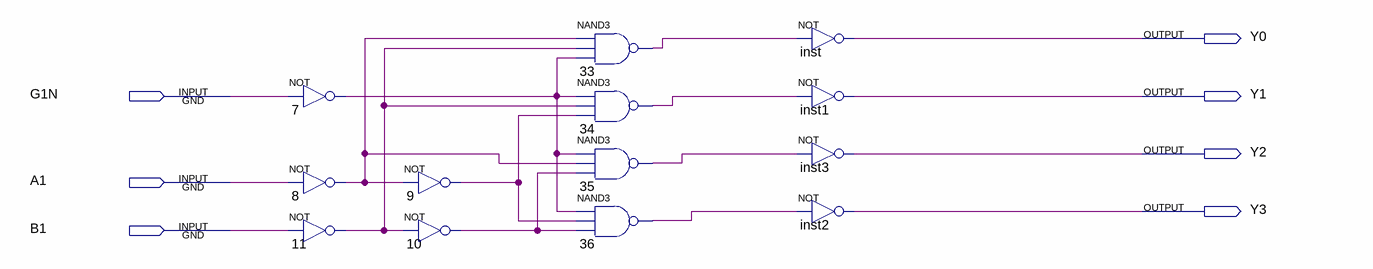
[diagram p0: schematic sheet]
// Quartus schematic DMUX.bdf as structural Verilog: 13 symbols, 7 pins
module DMUX (
  input  G1N,
  input  A1,
  input  B1,
  output Y0,
  output Y1,
  output Y2,
  output Y3
);

  wire n7_out, n8_out, n9_out, n10_out, n11_out, n33_out, n34_out, n35_out, n36_out;

  not u_7 (n7_out, G1N);
  not u_8 (n8_out, A1);
  not u_11 (n11_out, B1);
  not u_9 (n9_out, n8_out);
  not u_10 (n10_out, n11_out);
  nand u_33 (n33_out, n8_out, n11_out, n7_out);
  nand u_34 (n34_out, n7_out, n11_out, n9_out);
  nand u_35 (n35_out, n7_out, n8_out, n10_out);
  nand u_36 (n36_out, n7_out, n9_out, n10_out);
  not inst (Y0, n33_out);
  not inst1 (Y1, n34_out);
  not inst3 (Y2, n35_out);
  not inst2 (Y3, n36_out);
endmodule
